# EAGLE design MaTouch ESP32-S3 MaUWB SPI TFT Touch 3.95'' ST7796  v1.1 (EAGLE 6.1)
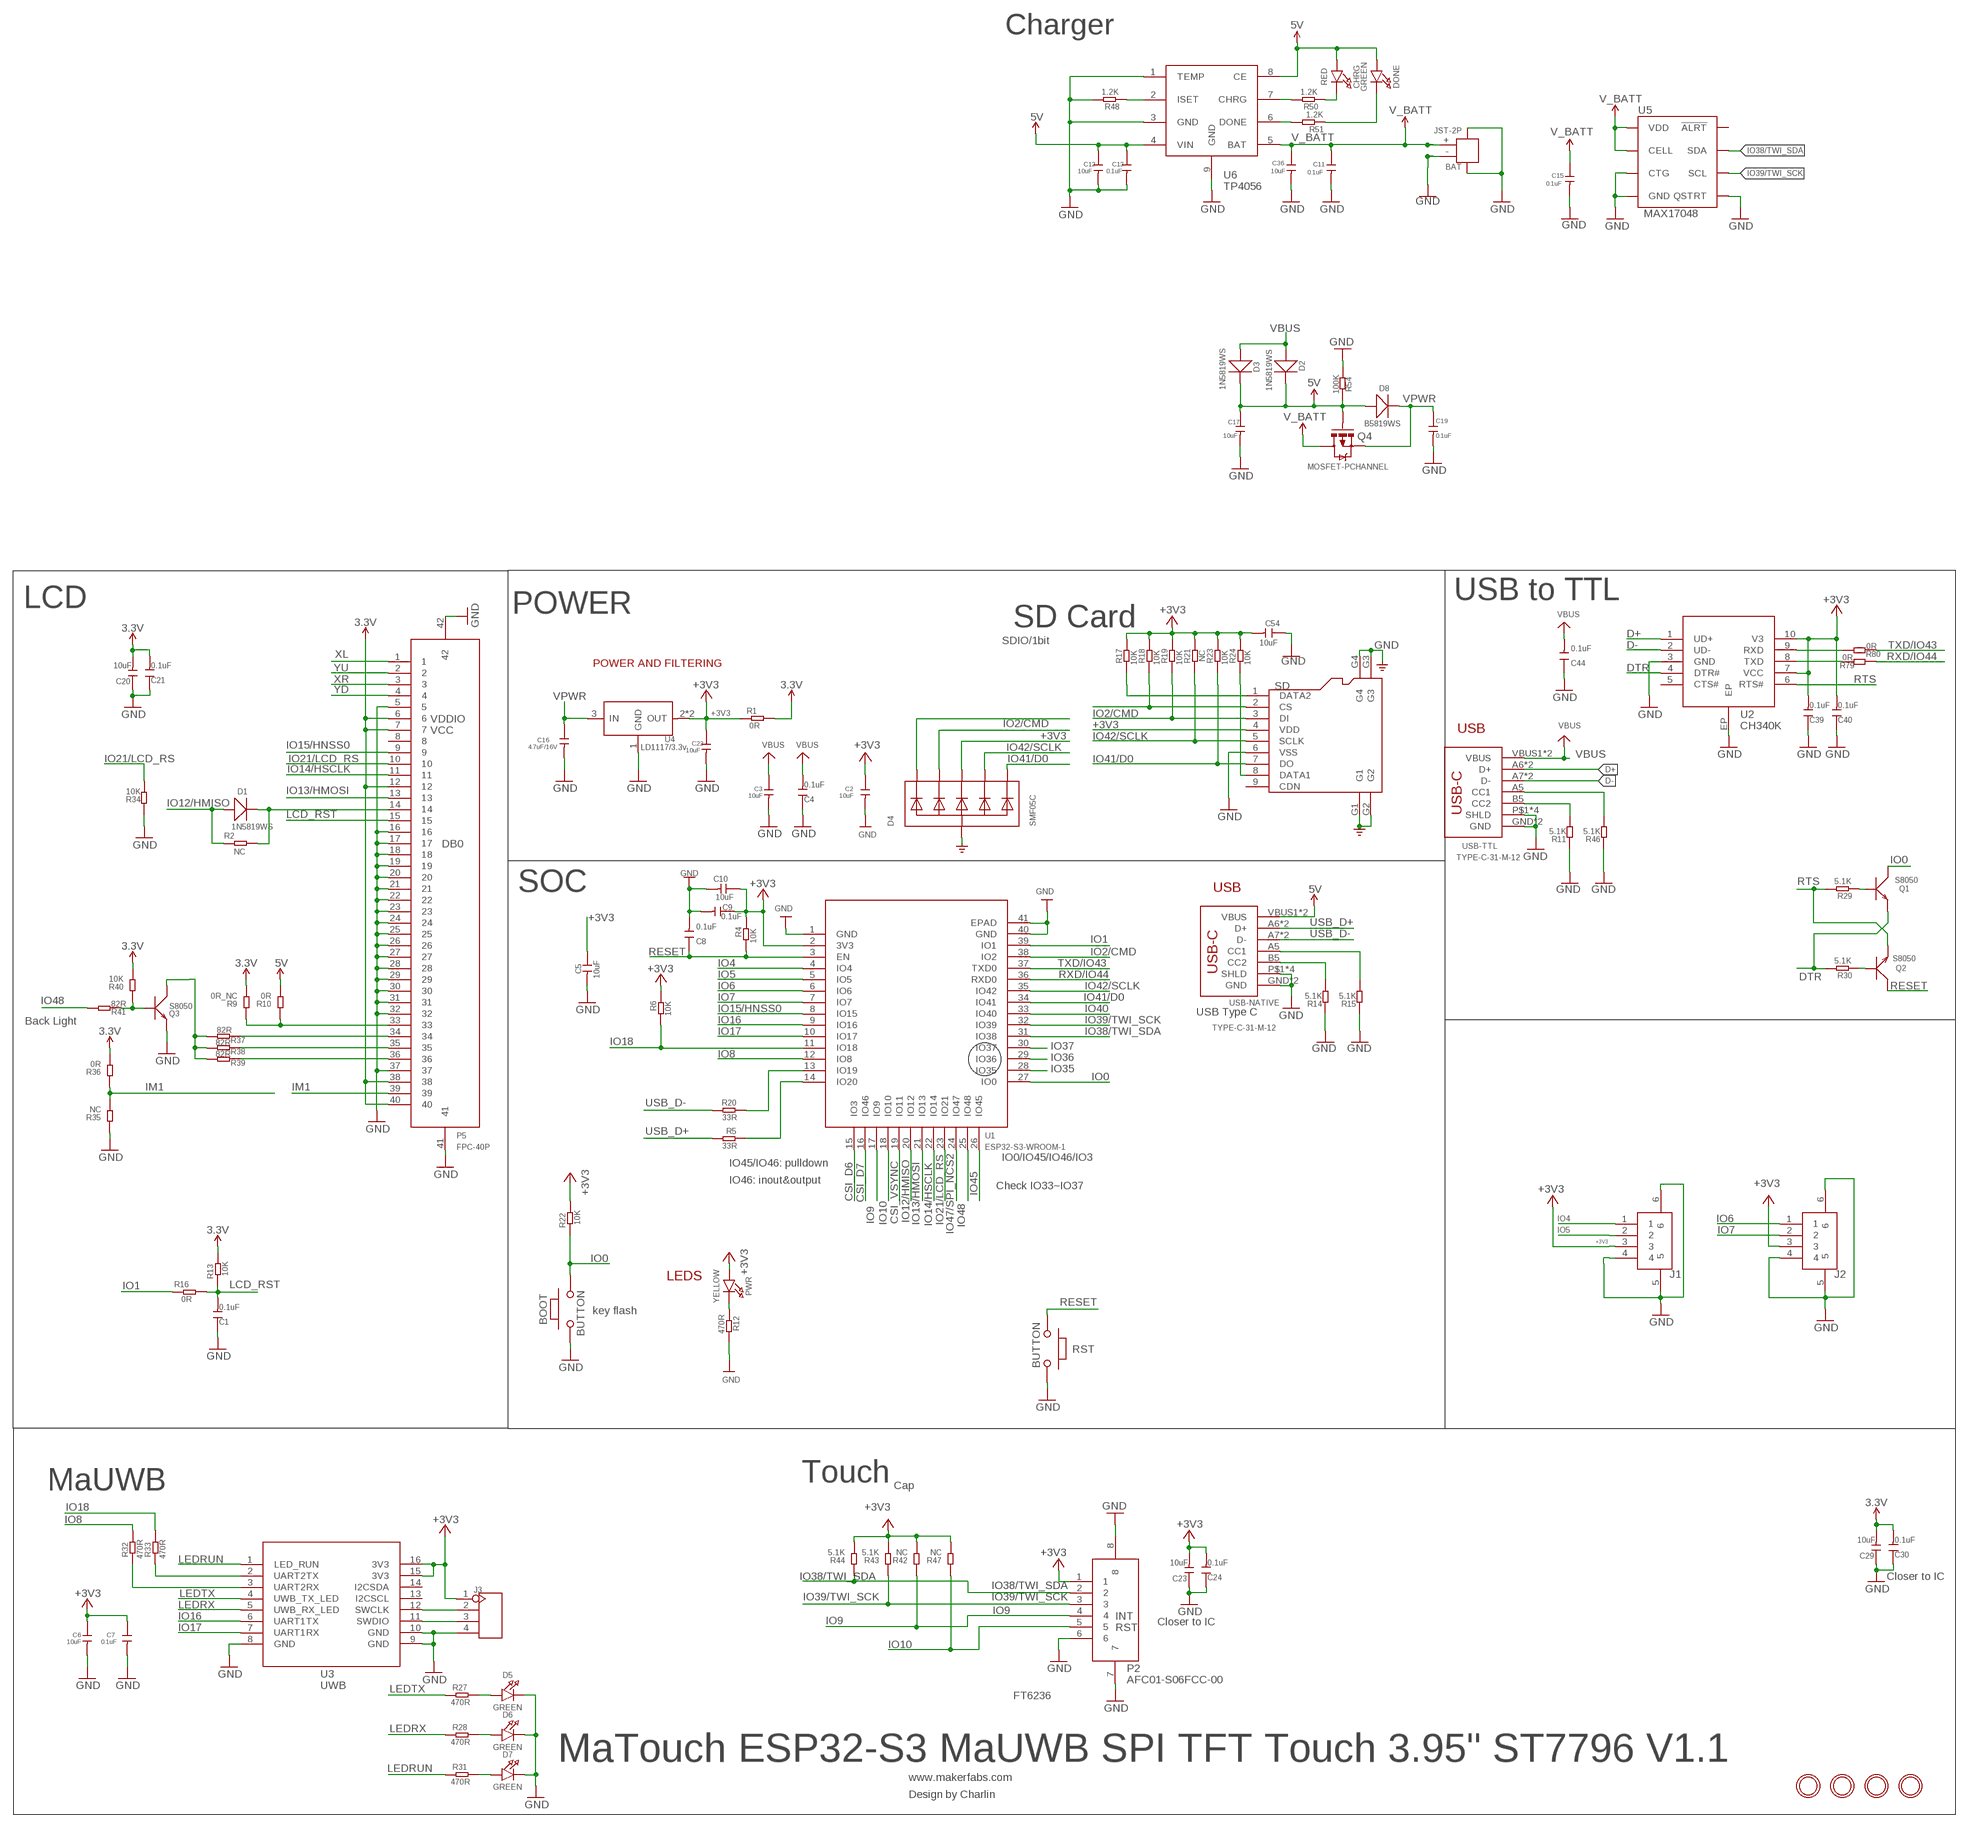
[diagram p0: schematic, sheet 1]

## Parts
BAT  JST-2P  JST-2P-SMD'2.0'  [HW2-SMD-2.0-90D]
BOOT  BUTTON  PB157  [157SW]
C1  0.1uF  DISCRETE_C-0603  [DISCRETE_C0603]
C2  10uF  C-0603  [C0603]
C3  10uF  C-0603  [C0603]
C4  0.1uF  DISCRETE_C-0603  [DISCRETE_C0603]
C5  10uF  DISCRETE_C-0603  [DISCRETE_C0603]
C6  10uF  C-0603  [C0603]
C7  0.1uF  C-0603  [C0603]
C8  0.1uF  DISCRETE_C-0603  [DISCRETE_C0603]
C9  0.1uF  DISCRETE_C-0603  [DISCRETE_C0603]
C10  10uF  DISCRETE_C-0603  [DISCRETE_C0603]
C11  0.1uF  C-0603  [C0603]
C12  10uF  C-0603  [C0603]
C13  0.1uF  C-0603  [C0603]
C15  0.1uF  C-0603  [C0603]
C16  4.7uF/16V  C-0603  [C0603]
C17  10uF  C-0603  [C0603]
C19  0.1uF  C-0603  [C0603]
C20  10uF  DISCRETE_C-0603  [DISCRETE_C0603]
C21  0.1uF  DISCRETE_C-0603  [DISCRETE_C0603]
C22  10uF  C-0603  [C0603]
C23  10uF  DISCRETE_C-0603  [DISCRETE_C0603]
C24  0.1uF  DISCRETE_C-0603  [DISCRETE_C0603]
C29  10uF  DISCRETE_C-0603  [DISCRETE_C0603]
C30  0.1uF  DISCRETE_C-0603  [DISCRETE_C0603]
C36  10uF  C-0603  [C0603]
C39  0.1uF  DISCRETE_C-0603  [DISCRETE_C0603]
C40  0.1uF  DISCRETE_C-0603  [DISCRETE_C0603]
C44  0.1uF  DISCRETE_C-0603  [DISCRETE_C0603]
C54  10uF  DISCRETE_C-0603  [DISCRETE_C0603]
CHRG  RED  LED0805_NOOUTLINE  [CHIPLED_0805_NOOUTLINE]
D1  1N5819WS  D'0805'  [SOD323]
D2  1N5819WS  D'0805'  [SOD323]
D3  1N5819WS  D'0805'  [SOD323]
D4  SMF05C  TVSARRAY_5LANE  [SOT363]
D5  GREEN  LED0805_NOOUTLINE  [CHIPLED_0805_NOOUTLINE]
D6  GREEN  LED0805_NOOUTLINE  [CHIPLED_0805_NOOUTLINE]
D7  GREEN  LED0805_NOOUTLINE  [CHIPLED_0805_NOOUTLINE]
D8  B5819WS  D'0805'  [SOD323]
DONE  GREEN  LED0805_NOOUTLINE  [CHIPLED_0805_NOOUTLINE]
H1  MICROBUILDER_MOUNTINGHOLE3.0THIN  [MICROBUILDER_MOUNTINGHOLE_3.0_PLATEDTHIN]
H2  MICROBUILDER_MOUNTINGHOLE3.0THIN  [MICROBUILDER_MOUNTINGHOLE_3.0_PLATEDTHIN]
H3  MICROBUILDER_MOUNTINGHOLE3.0THIN  [MICROBUILDER_MOUNTINGHOLE_3.0_PLATEDTHIN]
H4  MICROBUILDER_MOUNTINGHOLE3.0THIN  [MICROBUILDER_MOUNTINGHOLE_3.0_PLATEDTHIN]
J1  CON4-1.25P-SMD  [SMD4-125P-1000L525W350H]
J2  CON4-1.25P-SMD  [SMD4-125P-1000L525W350H]
J3  HEADER-4P-60/35MILROUND  [4P-65/35ROUND]
P2  AFC01-S06FCC-00  [SMD8-50P-740L535W]
P5  FPC-40P  [SMD42-50P-2560L490W]
PWR  YELLOW  LED0805_NOOUTLINE  [CHIPLED_0805_NOOUTLINE]
Q1  S8050  TRANSISTOR-NPN-SOT23  [SOT23]
Q2  S8050  TRANSISTOR-NPN-SOT23  [SOT23]
Q3  S8050  TRANSISTOR-NPN-SOT23  [SOT23]
Q4  MOSFET-PCHANNEL  [SOT23-3]
R1  0R  R-0603  [R0603]
R2  NC  R-0603  [R0603]
R4  10K  R-0603  [R0603]
R5  33R  R-0603  [R0603]
R6  10K  R-0603  [R0603]
R9  0R_NC  DISCRETE_R-0603  [DISCRETE_R0603]
R10  0R  DISCRETE_R-0603  [DISCRETE_R0603]
R11  5.1K  DISCRETE_R-0603  [DISCRETE_R0603]
R12  470R  R-0603  [R0603]
R13  10K  R-0603  [R0603]
R14  5.1K  DISCRETE_R-0603  [DISCRETE_R0603]
R15  5.1K  DISCRETE_R-0603  [DISCRETE_R0603]
R16  0R  R-0603  [R0603]
R17  10K  R-0603  [R0603]
R18  10K  R-0603  [R0603]
R19  10K  R-0603  [R0603]
R20  33R  R-0603  [R0603]
R21  NC  R-0603  [R0603]
R22  10K  R-0603  [R0603]
R23  10K  R-0603  [R0603]
R24  10K  R-0603  [R0603]
R27  470R  R-0603  [R0603]
R28  470R  R-0603  [R0603]
R29  5.1K  R-0603  [R0603]
R30  5.1K  R-0603  [R0603]
R31  470R  R-0603  [R0603]
R32  470R  R-0603  [R0603]
R33  470R  R-0603  [R0603]
R34  10K  DISCRETE_R-0603  [DISCRETE_R0603]
R35  NC  DISCRETE_R-0603  [DISCRETE_R0603]
R36  0R  DISCRETE_R-0603  [DISCRETE_R0603]
R37  82R  DISCRETE_R-0603  [DISCRETE_R0603]
R38  82R  DISCRETE_R-0603  [DISCRETE_R0603]
R39  82R  DISCRETE_R-0603  [DISCRETE_R0603]
R40  10K  DISCRETE_R-0603  [DISCRETE_R0603]
R41  82R  DISCRETE_R-0603  [DISCRETE_R0603]
R42  NC  DISCRETE_R-0603  [DISCRETE_R0603]
R43  5.1K  DISCRETE_R-0603  [DISCRETE_R0603]
R44  5.1K  DISCRETE_R-0603  [DISCRETE_R0603]
R46  5.1K  DISCRETE_R-0603  [DISCRETE_R0603]
R47  NC  DISCRETE_R-0603  [DISCRETE_R0603]
R48  1.2K  R-0603  [R0603]
R50  1.2K  R-0603  [R0603]
R51  1.2K  R-0603  [R0603]
R54  100K  R-0603  [R0603]
R79  0R  R-0603  [R0603]
R80  0R  R-0603  [R0603]
RST  BUTTON  PB157  [157SW]
SD  HOLDER-MICROSD-9P  [9P-SMD-W/-RING]
U1  ESP32-S3-WROOM-1  [ESP32-S3-WROOM-1]
U2  CH340K  [ESOP-10-EP-150MIL]
U3  UWB  [UWB]
U4  LD1117/3.3v  LD1117'SOT89'  [SOT89]
U5  MAX17048  MAX17048DFN8  [DFN-8]
U6  TP4056  [SOP8-1.27P]
USB-NATIVE  TYPE-C-31-M-12  [TYPE-C-31-M-12]
USB-TTL  TYPE-C-31-M-12  [TYPE-C-31-M-12]

## Nets
5V: C12.1 C13.1 C17.1 CHRG.A D2.- D3.- D8.+ DONE.A Q4.1(G) R10.2 R54.2 U6.4(VIN) U6.8(CE) USB-NATIVE.VBUS1(VBUS) USB-NATIVE.VBUS2(VBUS)
+3V3: C2.1 C5.1 C6.1 C7.1 C9.1 C10.1 C20.2 C21.2 C22.1 C23.2 C24.2 C29.2 C30.2 C39.2 C40.2 C54.2 D4.4(C3) J1.3 J2.3 J3.1 P2.1 P5.6 P5.7 P5.12 P5.38 P5.40 PWR.A R1.1 R1.2 R4.2 R6.2 R9.2 R13.2 R17.2 R18.2 R19.2 R21.2 R22.2 R23.2 R24.2 R36.2 R40.2 R42.2 R43.2 R44.2 R47.2 SD.4(VDD) U1.2(3V3) U2.7(VCC) U2.10(V3) U3.15(3V3) U3.16(3V3) U4.2(OUT) U4.4(OUT) ; supply symbol labelled 3.3V
CSI_D6: U1.15(IO3)
CSI_D7: U1.16(IO46)
CSI_VSYNC: U1.19(IO11)
D+: U2.1(UD+) USB-TTL.A6(D+) USB-TTL.B6(D+)
D-: U2.2(UD-) USB-TTL.A7(D-) USB-TTL.B7(D-)
DTR: Q1.2(E) R30.2 U2.4(DTR#)
GND: BAT.3 BAT.4 BAT.- BOOT.1 C1.1 C2.2 C3.2 C4.1 C5.2 C6.2 C7.2 C8.2 C9.2 C10.2 C11.2 C12.2 C13.2 C15.2 C16.2 C17.2 C19.2 C20.1 C21.1 C22.2 C23.1 C24.1 C29.1 C30.1 C36.2 C39.1 C40.1 C44.1 C54.1 D4.2(A) D5.C D6.C D7.C J1.4 J1.5 J1.6 J2.4 J2.5 J2.6 J3.4 P2.6 P2.7 P2.8 P5.5 P5.16 P5.17 P5.18 P5.19 P5.20 P5.21 P5.22 P5.23 P5.24 P5.25 P5.26 P5.27 P5.28 P5.29 P5.30 P5.31 P5.32 P5.37 P5.41 P5.42 Q3.2(E) R11.1 R12.2 R14.1 R15.1 R34.1 R35.1 R46.1 R48.2 R54.1 RST.1 SD.6(VSS) SD.G1 SD.G2 SD.G3 SD.G4 U1.1(GND) U1.40(GND) U1.41(EPAD) U2.3(GND) U2.EP U3.8(GND) U3.9(GND) U3.10(GND) U4.1(GND) U5.1(CTG) U5.4(GND) U5.6(QSTRT) U5.9(GND) U6.1(TEMP) U6.3(GND) U6.9(GND) USB-NATIVE.GND USB-NATIVE.GND2(GND) USB-NATIVE.P$1(SHLD) USB-NATIVE.P$2(SHLD) USB-NATIVE.P$3(SHLD) USB-NATIVE.P$4(SHLD) USB-TTL.GND USB-TTL.GND2(GND) USB-TTL.P$1(SHLD) USB-TTL.P$2(SHLD) USB-TTL.P$3(SHLD) USB-TTL.P$4(SHLD)
IM1: P5.39 R35.2 R36.1
IO0: BOOT.2 Q1.3(C) R22.1 U1.27(IO0)
IO1: R16.1 U1.39(IO1)
IO1/CS: D4.1(C1) R18.1 SD.2(CS)
IO2/CMD: D4.3(C2) R19.1 SD.3(DI) U1.38(IO2)
IO4: J1.1 U1.4(IO4)
IO5: J1.2 U1.5(IO5)
IO6: J2.1 U1.6(IO6)
IO7: J2.2 U1.7(IO7)
IO8: R32.2 U1.12(IO8)
IO9: P2.4 R42.1 U1.17(IO9)
IO10: P2.5 R47.1 U1.18(IO10)
IO12/HMISO: D1.+ R2.1 U1.20(IO12)
IO13/HMOSI: P5.13 U1.21(IO13)
IO14/HSCLK: P5.11 U1.22(IO14)
IO15/HNSS0: P5.9 U1.8(IO15)
IO16: U1.9(IO16) U3.6(UART1TX)
IO17: U1.10(IO17) U3.7(UART1RX)
IO18: R6.1 R33.2 U1.11(IO18)
IO21/LCD_RS: P5.10 R34.2 U1.23(IO21)
IO35: U1.28(IO35)
IO36: U1.29(IO36)
IO37: U1.30(IO37)
IO38/TWI_SDA: P2.2 R44.1 U1.31(IO38) U5.8(SDA)
IO39/TWI_SCK: P2.3 R43.1 U1.32(IO39) U5.7(SCL)
IO40: U1.33(IO40)
IO41/D0: D4.6(C5) R23.1 SD.7(DO) U1.34(IO41)
IO42/SCLK: D4.5(C4) R21.1 SD.5(SCLK) U1.35(IO42)
IO45: U1.26(IO45)
IO47/SPI_NCS2: U1.24(IO47)
IO48: R41.2 U1.25(IO48)
LCD_RST: C1.2 P5.15 R13.1 R16.2
LEDRUN: R31.1 U3.1(LED_RUN)
LEDRX: R28.1 U3.5(UWB_RX_LED)
LEDTX: R27.1 U3.4(UWB_TX_LED)
N$1: R46.2 USB-TTL.A5(CC1)
N$2: D5.A R27.2
N$3: D6.A R28.2
N$4: D1.- P5.14 R2.2
N$5: Q2.1(B) R30.1
N$6: D7.A R31.2
N$7: PWR.C R12.1
N$8: Q1.1(B) R29.1
N$9: R51.2 U6.6(DONE)
N$10: R33.1 U3.2(UART2TX)
N$11: R32.1 U3.3(UART2RX)
N$12: R48.1 U6.2(ISET)
N$13: R50.2 U6.7(CHRG)
N$14: R15.2 USB-NATIVE.A5(CC1)
N$15: R20.2 U1.13(IO19)
N$16: R5.2 U1.14(IO20)
N$17: R14.2 USB-NATIVE.B5(CC2)
N$18: R11.2 USB-TTL.B5(CC2)
N$19: CHRG.C R50.1
N$20: P5.34 R37.1
N$21: P5.35 R38.1
N$22: P5.36 R39.1
N$23: Q3.1(B) R40.1 R41.1
N$24: Q3.3(C) R37.2 R38.2 R39.2
N$26: P5.33 R9.1 R10.1
N$27: J3.3 U3.11(SWDIO)
N$28: J3.2 U3.12(SWCLK)
N$29: DONE.C R51.1
N$36: R80.2 U2.9(RXD)
N$37: R79.2 U2.8(TXD)
N$47: R17.1 SD.1(DATA2)
N$48: R24.1 SD.8(DATA1)
RESET: C8.1 Q2.3(C) R4.1 RST.2 U1.3(EN)
RTS: Q2.2(E) R29.2 U2.6(RTS#)
RXD/IO44: R79.1 U1.36(RXD0)
TXD/IO43: R80.1 U1.37(TXD0)
USB_D+: R5.1 USB-NATIVE.A6(D+) USB-NATIVE.B6(D+)
USB_D-: R20.1 USB-NATIVE.A7(D-) USB-NATIVE.B7(D-)
V_BATT: BAT.+ C11.1 C15.1 C36.1 Q4.3(D) U5.2(CELL) U5.3(VDD) U6.5(BAT)
VBUS: C3.1 C4.2 C44.2 D2.+ D3.+ USB-TTL.VBUS1(VBUS) USB-TTL.VBUS2(VBUS)
VPWR: C16.1 C19.1 D8.- Q4.2(S) U4.3(IN)
XL: P5.1
XR: P5.3
YD: P5.4
YU: P5.2
Unconnected: P5.8 SD.9(CDN) U2.5(CTS#) U3.13(I2CSCL) U3.14(I2CSDA) U5.5(!ALRT)

## Notes on the sheet
- Charger
- LCD | USB to TTL
- POWER
- SD Card
- SDIO/1bit
- POWER AND FILTERING
- VDDIO
- VCC | USB
- DB0
- SOC | USB
- USB Type C
- Back Light
- IO0/IO45/IO46/IO3
- IO45/IO46: pulldown
- IO46: inout&output
- Check IO33~IO37
- LEDS
- key flash
- Touch
- MaUWB | Cap
- Closer to IC
- INT
- Closer to IC
- RST
- FT6236
- MaTouch ESP32-S3 MaUWB SPI TFT Touch 3.95" ST7796 V1.1
- www.makerfabs.com
- Design by Charlin

## Library data of the parts
BAT = Connector-new:JST-2P-SMD: 2P-SMD-1.0-90D:320110054;2P-SMD-2.0-90D:320110026
BOOT RST = MySMD:PB157
C1 C4 C5 C8-C10 C20 C21 C23 C24 C29 C30 C39 C40 C44 C54 = A9G:DISCRETE_C*: Ceramic Capacitors
C2 C3 C6 C7 C11-C13 C15-C17 C19 C22 C36 = Discrete:C*: Ceramic Capacitors
CHRG D5-D7 DONE PWR = microbuilder:LED: LED 0603 - 0603 Surface Mount Package 2mA: Green LED - Low Power (3.9mcd, 2ma, 1.7Vf) - Digikey: 475-2709-2-ND Orange LED - Low Power (9.8mcd, 2ma, 1.8Vf) - Digikey: 475-1194-2-ND Red LED - Low Power (5mcd, 2ma, 1.8Vf) - Digikey: 475-1195-2-ND Yellow LED - Low Power (7mcd, 2ma, 1.8Vf) - Digikey: 475-1196-2-ND 5mA: Blue LED - Low Power (17mcd, 5ma, 2.9Vf) - Digikey: LNJ937W8CRACT-ND 0805 - 0805 Surface Mount Package 2mA: Red LED (8.8mcd, 2mA, 1.8Vf, Clear) - Low Power [Digikey: 475-2510-1-ND] Green LED (5mcd, 2mA, 1.8Vf, Clear) - Low Power [Digikey: 475-2730-1-ND] Yellow LED (11.3mcd, 2mA, 1.8Vf, Clear) - Low Power [Digikey: 475-2555-1-ND] 20mA: Red LED (104mcd, 20mA, Diffused) - LS R976 [Digikey: 475-1278-6-ND] Red LED (12mcd, 20mA, 2.0Vf, Clear) - APT2012EC [Digikey: 754-1128-1-ND] Green LED (15mcd, 20mA, 2.2Vf, Clear) - APT2012GC [Digikey: 754-1131-1-ND] Orange LED (160mcd, 20mA, 2.1Vf, Clear) - APT2012SECK [Digikey: 754-1130-1-ND] 1206 - 1206 Surface Mount Package Green LED (26mcd, 20mA, Diffused) - LG N971 [Digikey: 475-1407-6-ND] Red LED (15mcd, 20mA, Diffused) - LH N974 [Digikey: 475-1416-6-ND] Cree - Cree High-Power Surface Mount LEDs XPEBWT-L1-0000-00D50 - White 111lm 350mA 2.9Vf 6200K 110° XTEAWT-00-0000-00000LEE3 - White 114lm 350mA 2.85Vf 5000K 115° Everlight - Everlight 45-21 Series Surface Mount LEDs 45-21/QK2C-B2832AC2CB2/2T - Warm White 2000mcd 20mA 3.25Vf 3050K 120° 45-21/LK2C-B38452C4CB2/2T - Nuetral White 2000mcd 20mA 3.25Vf 4150K 120° 45-21/LK2C-B50634C6CB2/2T - Cold White 2200mcd 20mA 3.25Vf 5650K 120° PLCC2 Reverse Mount LS T77K-J1L2-1-0-2-R18-Z - Red 11.25mcd 2mA 1.8Vf 630nm 120° LO T77K-L1M2-24-Z - Orange 19.6mcd 2mA 1.8Vf 606nm 120° LY T77K-K2M1-26-Z - Yellow 15.7mcd 2mA 1.8Vf 587nm 120°
D1-D3 D8 = Discrete:D*
D4 = microbuilder:TVSARRAY_5LANE: Voltage Transient Suppressor Array SOT363 SMF05C - 100W 5V: Digikey - SMF05CT1GOSCT-ND
H1-H4 = Adafruit UDA1334 I2S DAC:MICROBUILDER_MOUNTINGHOLE: Mounting Hole For #2 screws (0.086"/2.18mm width, 0.094"/2.4mm hole) use 2.5mm; BOM: EXCLUDE
J1 J2 = user:CON4-1.25P-SMD
J3 = Connector:HEADER-4P
P2 = self:AFC01-S06FCC-00
P5 = self:FPC-40P
Q1-Q3 = Discrete:TRANSISTOR-NPN*: NPN audion
Q4 = User-Submitted:MOSFET-PCHANNEL: Generic PMOSFET IRLML2244 - TRANS-11153 (SOT-23 -20V -4.3A) (1.Gate 2.Source 3.Drain) FQP27P06 - COM-10349 <http://www.sparkfun.com/products/10349> (TO-220 -60V -27A) (1.Gate 2.Source 3.Drain); PROD_ID: TRANS-08285
R1 R2 R4-R6 R12 R13 R16-R24 R27-R33 R48 R50 R51 R54 R79 R80 = Discrete:R*
R9-R11 R14 R15 R34-R44 R46 R47 = A9G:DISCRETE_R*
SD = Connector:HOLDER-MICROSD-9P
U1 = self:ESP32-S3-WROOM-1
U2 = sale:CH340K
U3 = sale:UWB
U4 = IC:LD1117: Low Drop Fixed And Adjustable Positive Voltage Regulators http://www.datasheetcatalog.org/datasheet/SGSThomsonMicroelectronics/mXuqtqv.pdf
U5 = SparkFun-IC-Power:MAX17048: Micropower 1-Cell Li+ ModelGauge SparkFun Products Qduino Mini <https://www.sparkfun.com/products/13614> (DEV-13614); PROD_ID: IC-12551
U6 = self:TP4056
USB-NATIVE USB-TTL = sale:TYPE-C-31-M-12

## Net classes
0 default: width 0.203 mm, drill 0.305 mm, clearance 0.152 mm
1 vbat: width 0.254 mm, drill 0.305 mm, clearance 0.152 mm

## Board
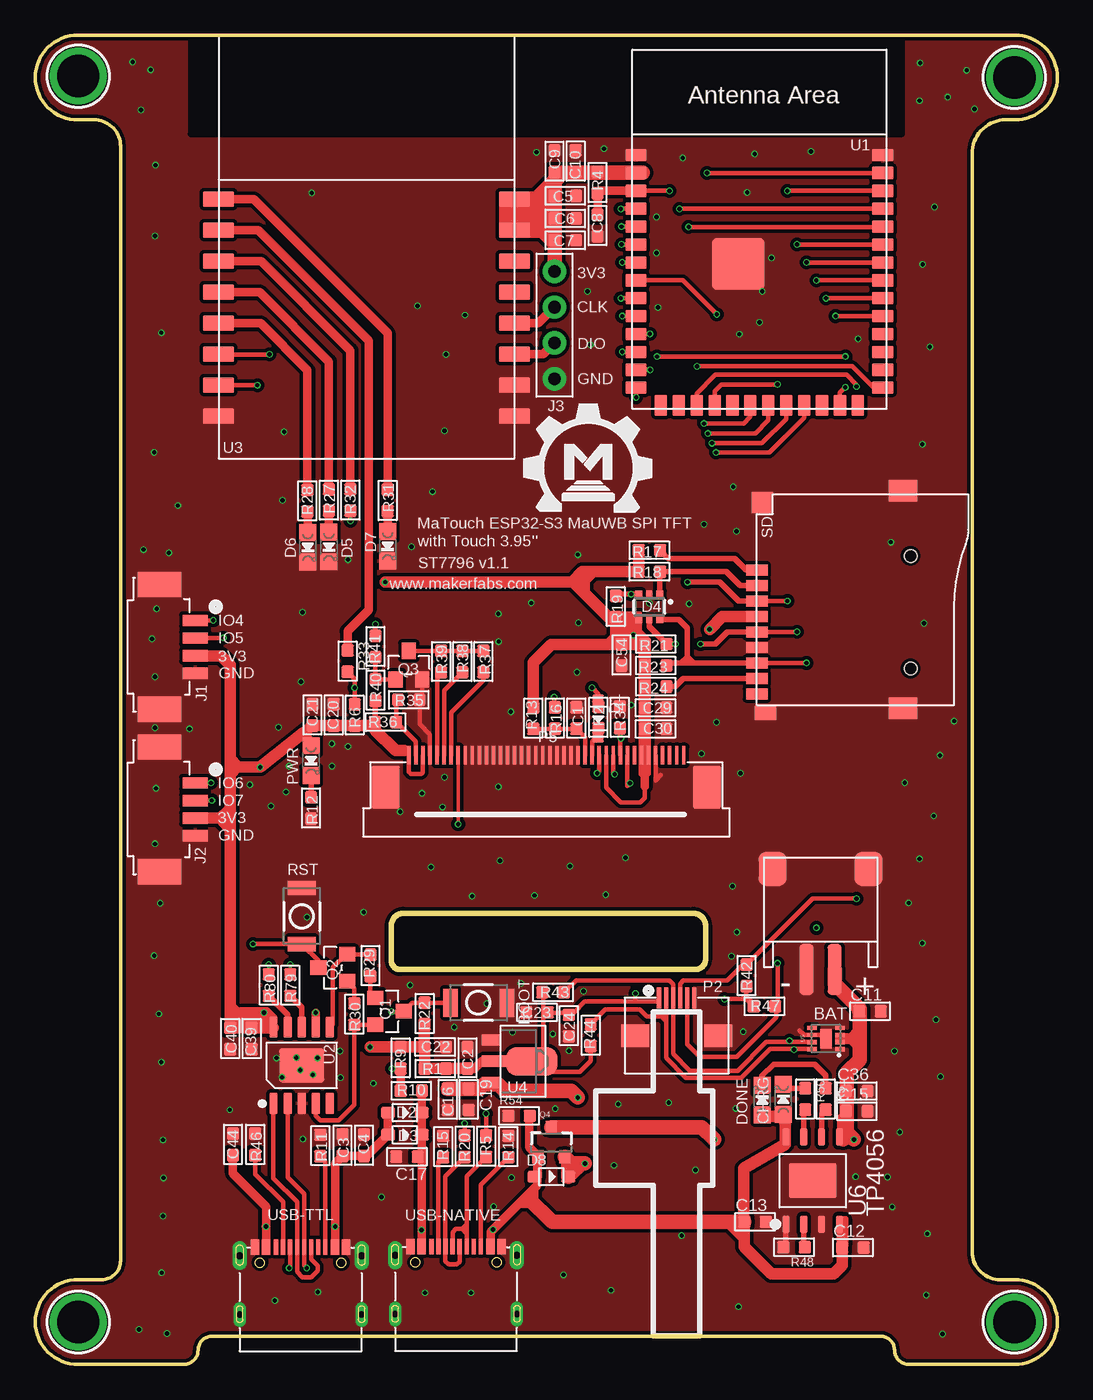
[diagram p1: board, top side]
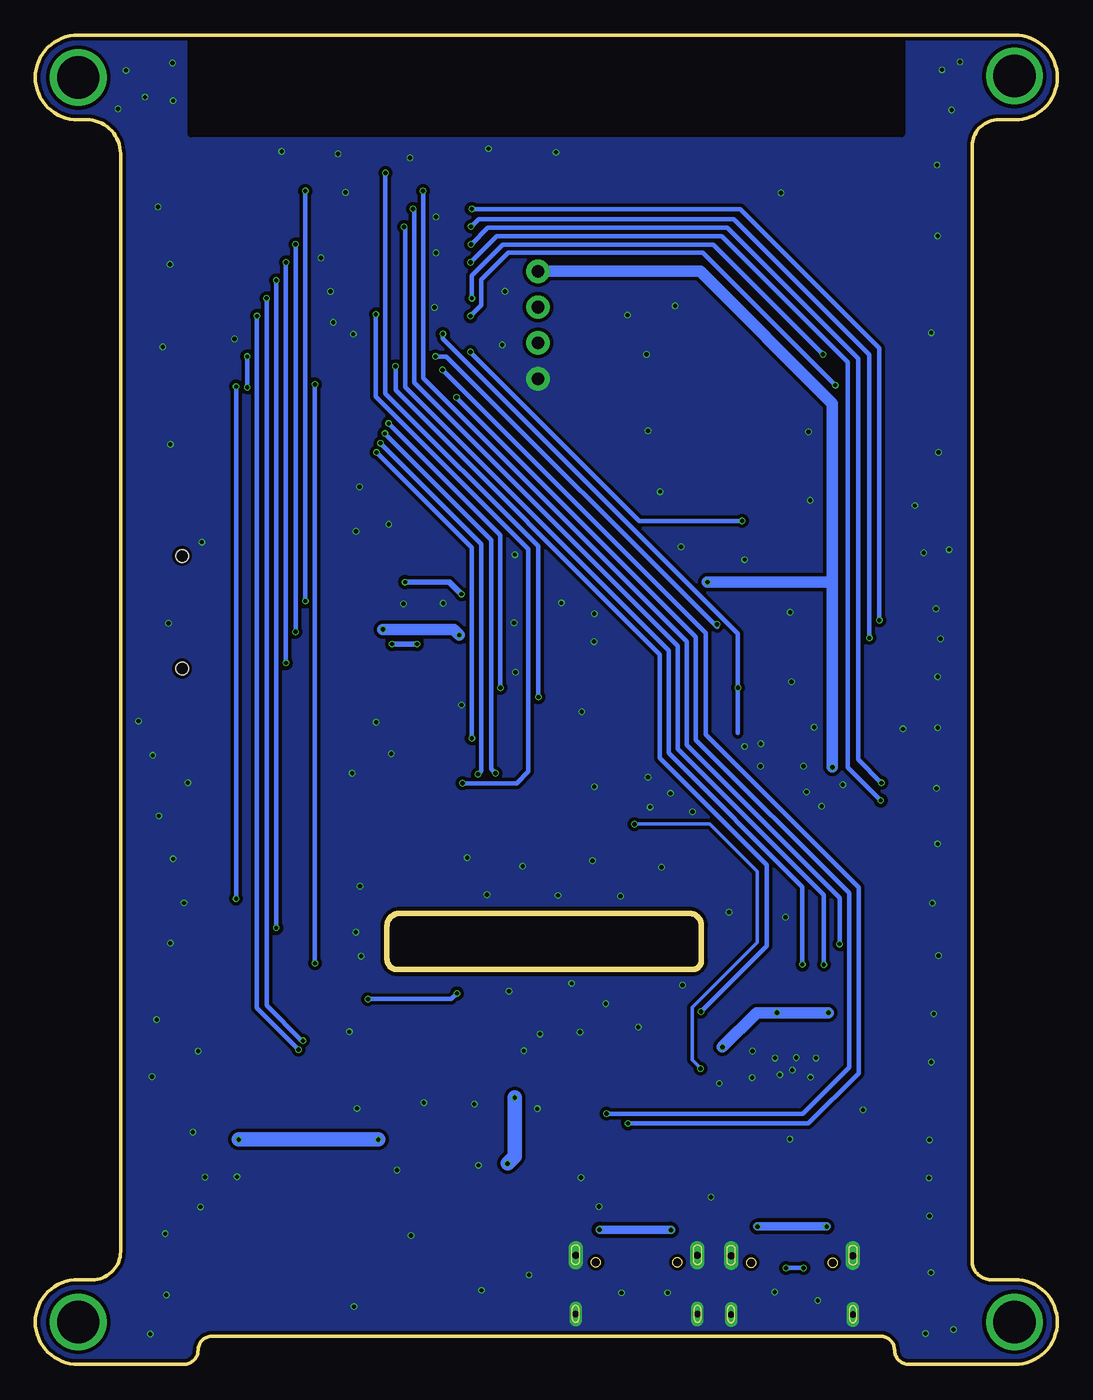
[diagram p2: board, bottom side, seen from below]

Size 72.5 x 94.3 mm. Coordinates in mm from the lower left corner, seen from the top.
Outline: 61.95,0 69.45,0 arc182 69.45,6 68.45,6 arc-90 66.45,8 66.45,85.9 arc-90 68.85,88.3 69.45,88.3 arc182 69.45,94.3 3.05,94.3 arc182 3.05,88.3 4.17,88.3 arc-90 6.05,86.42 6.05,7.34 arc-90 4.7,6 3.05,6 arc182 3.05,0 10.55,0 arc90 11.55,1 arc-90 12.55,2 59.95,2 arc-90 60.95,1 arc90 61.95,0
Outline: 26.13,32 46.64,32 arc-90 47.55,31.1 47.55,28.75 arc-90 46.8,28 25.91,28 arc-90 25.25,28.66 25.25,31.12 arc-90 26.13,32
Copper layers (1*16): Top 0.035mm / dielectric 1.5mm / Bottom 0.035mm
Design rules: minimum track width 6mil, minimum drill 10mil, track to track 8mil, track to pad 8mil, pad to pad 8mil, via to via 8mil, smd to smd 0mil, copper to edge 10mil, drill to drill 10mil, minimum pad ring 3mil, minimum via ring 3mil, stop-mask expansion 2mil, vias tented up to drill 100mil, thermal gap 0mil
tRestrict: area 11,87.3 to 61.4,95
bRestrict: area 11,87.3 to 61.4,95

### Footprints (pad centres in the part's own frame; a part is rotated, then mirrored left to right if it is on the bottom)
HW2-SMD-2.0-90D = smd 2 x 2.4: 3 3.4,-2.181; 4 -3.4,-2.181 | smd 1 x 3.6: + -1,4.953; - 1,4.953
157SW = smd 1.016 x 1.981: 1 0,0; 2 4,0
DISCRETE_C0603 = smd 0.889 x 0.889: 1 -0.762,0; 2 0.762,0
C0603 = smd 0.889 x 0.889: 1 -0.762,0; 2 0.762,0
CHIPLED_0805_NOOUTLINE = smd 1.2 x 1.2: A 0,-1.05; C 0,1.05
SOD323 = smd 1 x 0.8: + -1.2,0; - 1.2,0
SOT363 = smd 0.5 x 0.5: 1 -0.75,-0.9; 3 0.75,-0.9; 4 0.75,0.9; 6 -0.75,0.9 | smd 0.4 x 0.5: 2 0,-0.9; 5 0,0.9
MICROBUILDER_MOUNTINGHOLE_3.0_PLATEDTHIN = drill 3 pad 3.6: P$1 0,0
SMD4-125P-1000L525W350H = smd 0.8 x 1.8: 1 -1.875,1.266; 2 -0.625,1.266; 3 0.625,1.266; 4 1.875,1.266 | smd 1.8 x 3.1: 5 4.425,-1.266; 6 -4.425,-1.266
4P-65/35ROUND = drill 0.889 pad 1.651: 1 0,3.81; 2 0,1.27; 3 0,-1.27; 4 0,-3.81
SMD8-50P-740L535W = smd 0.3 x 1.5: 1 -1.25,0; 2 -0.75,0; 3 -0.25,0; 4 0.25,0; 5 0.75,0; 6 1.25,0 | smd 2 x 1.6: 7 2.95,-2.68; 8 -2.95,-2.68
SMD42-50P-2560L490W = smd 0.3 x 1.3: 1 9.75,0; 2 9.25,0; 3 8.75,0; 4 8.25,0; 5 7.75,0; 6 7.25,0; 7 6.75,0; 8 6.25,0; 9 5.75,0; 10 5.25,0; 11 4.75,0; 12 4.25,0; 13 3.75,0; 14 3.25,0; 15 2.75,0; 16 2.25,0; 17 1.75,0; 18 1.25,0; 19 0.75,0; 20 0.25,0; 21 -0.25,0; 22 -0.75,0; 23 -1.25,0; 24 -1.75,0; 25 -2.25,0; 26 -2.75,0; 27 -3.25,0; 28 -3.75,0; 29 -4.25,0; 30 -4.75,0; 31 -5.25,0; 32 -5.75,0; 33 -6.25,0; 34 -6.75,0; 35 -7.25,0; 36 -7.75,0; 37 -8.25,0; 38 -8.75,0; 39 -9.25,0; 40 -9.75,0 | smd 2 x 3: 41 -11.4,-2.25; 42 11.4,-2.25
SOT23 = smd 1.016 x 1.143: 1 -0.95,-1.016; 2 0.95,-1.016; 3 0,1.016
SOT23-3 = smd 0.8 x 0.9: 1 -0.95,-1; 2 0.95,-1; 3 0,1.1
R0603 = smd 0.889 x 0.889: 1 -0.762,0; 2 0.762,0
DISCRETE_R0603 = smd 0.889 x 0.889: 1 -0.762,0; 2 0.762,0
9P-SMD-W/-RING = smd 1.524 x 0.762: 1 0,4.4; 2 0,3.3; 3 0,2.2; 4 0,1.1; 5 0,0; 6 0,-1.1; 7 0,-2.2; 8 0,-3.3; 9 0,-4.4 | smd 1.524 x 1.016: G1 0.6,-5.746 | smd 2.032 x 1.524: G2 10.373,-5.4; G3 10.373,10 | smd 1.524 x 1.524: G4 0.392,9.181 | hole 0.889: 10.9,-2.6; 10.9,5.4
ESP32-S3-WROOM-1 = smd 1.5 x 0.9: 1 -8.75,5.26; 2 -8.75,3.99; 3 -8.75,2.72; 4 -8.75,1.45; 5 -8.75,0.18; 6 -8.75,-1.09; 7 -8.75,-2.36; 8 -8.75,-3.63; 9 -8.75,-4.9; 10 -8.75,-6.17; 11 -8.75,-7.44; 12 -8.75,-8.71; 13 -8.75,-9.98; 14 -8.75,-11.25; 27 8.75,-11.25; 28 8.75,-9.98; 29 8.75,-8.71; 30 8.75,-7.44; 31 8.75,-6.17; 32 8.75,-4.9; 33 8.75,-3.63; 34 8.75,-2.36; 35 8.75,-1.09; 36 8.75,0.18; 37 8.75,1.45; 38 8.75,2.72; 39 8.75,3.99; 40 8.75,5.26 | smd 0.9 x 1.5: 15 -6.985,-12.5; 16 -5.715,-12.5; 17 -4.445,-12.5; 18 -3.175,-12.5; 19 -1.905,-12.5; 20 -0.635,-12.5; 21 0.635,-12.5; 22 1.905,-12.5; 23 3.175,-12.5; 24 4.445,-12.5; 25 5.715,-12.5; 26 6.985,-12.5 | smd 3.7 x 3.7: 41 -1.5,-2.46
ESOP-10-EP-150MIL = smd 1.5 x 0.6: 1 -2.7,2; 2 -2.7,1; 3 -2.7,0; 4 -2.7,-1; 5 -2.7,-2; 6 2.7,-2; 7 2.7,-1; 8 2.7,0; 9 2.7,1; 10 2.7,2 | smd 2.4 x 3.2: EP 0,0
UWB = smd 2.2 x 1.1: 1 0,18.4; 2 0,16.2; 3 0,14; 4 0,11.8; 5 0,9.6; 6 0,7.4; 7 0,5.2; 8 0,3; 9 21,3; 10 21,5.2; 11 21,7.4; 12 21,9.6; 13 21,11.8; 14 21,14; 15 21,16.2; 16 21,18.4
SOT89 = smd 0.8 x 1.4: 1 -1.524,-1.905; 3 1.524,-1.905 | smd 0.8 x 1.9: 2 0,-1.651 | smd 2.032 x 3.65: 4 0,0.94
DFN-8 = smd 0.3 x 0.7: 1 -0.75,-0.99; 2 -0.25,-0.99; 3 0.25,-0.99; 4 0.75,-0.99; 5 0.75,0.99; 6 0.25,0.99; 7 -0.25,0.99; 8 -0.75,0.99 | smd 1.38 x 0.8: 9 0,0
SOP8-1.27P = smd 1.27 x 0.51: 1 -3.1,1.905; 2 -3.1,0.635; 3 -3.1,-0.635; 4 -3.1,-1.905; 5 3.1,-1.905; 6 3.1,-0.635; 7 3.1,0.635; 8 3.1,1.905 | smd 2.5 x 3.4: 9 0,0
TYPE-C-31-M-12 = smd 0.3 x 1.1: A5 -1.25,0.05; A6 -0.25,0.05; A7 0.25,0.05; A8 1.25,0.05; B5 1.75,0.05; B6 0.75,0.05; B7 -0.75,0.05; B8 -1.75,0.05 | smd 0.6 x 1.1: GND -3.225,0.05; GND2 3.225,0.05; VBUS1 -2.45,0.05; VBUS2 2.45,0.05 | drill 0.5 pad 1.016 long: P$1 4.32,-0.57; P$2 -4.32,-0.57 | drill 0.45 pad 0.9 long: P$3 -4.32,-4.75; P$4 4.32,-4.75

### Placement (x,y rotation side)
BAT  55.71,32.97 180 top
BOOT  33.45,25.66 180 top
C1  38.38,45.85 270 top
C2  30.66,21.74 90 top
C3  21.8,15.54 90 top
C4  23.32,15.54 270 top
C5  37.59,82.91 0 top
C6  37.59,81.31 0 top
C7  37.59,79.76 0 top
C8  39.88,80.8 270 top
C9  36.83,85.36 90 top
C10  38.33,85.37 90 top
C11  59.21,25.04 0 top
C12  57.99,8.28 0 top
C13  51.06,10.11 0 top
C15  58.27,17.96 0 top
C16  29.26,18.8 270 top
C17  26.37,14.73 180 top
C19  30.74,18.8 270 top
C20  21.16,46.08 270 top
C21  19.66,46.08 270 top
C22  28.36,22.51 0 top
C23  35.59,24.97 0 top
C24  37.85,24.03 90 top
C29  44,46.58 180 top
C30  44,45.09 180 top
C36  58.27,19.38 0 top
C39  15.34,23.11 90 top
C40  13.82,23.11 90 top
C44  14.02,15.6 270 top
C54  41.58,50.33 90 top
CHRG  53.06,18.8 0 top
D1  39.93,45.82 270 top
D2  26.22,17.86 0 top
D3  26.22,16.28 0 top
D4  43.55,53.75 180 top
D5  20.83,57.99 180 top
D6  19.33,57.96 180 top
D7  25,58.04 180 top
D8  36.6,13.31 0 top
DONE  51.56,18.75 0 top
H1  3.05,3 0 top
H2  69.45,3 0 top
H3  3.05,91.4 0 top
H4  69.45,91.3 0 top
J1  10.09,50.9 270 top
J2  10.09,39.37 270 top
J3  36.83,73.74 0 top
P2  45.5,26 0 top
P5  36.25,43.2 0 top
PWR  19.56,42.83 180 top
Q1  25.12,25.04 270 top
Q2  21.11,28.14 90 top
Q3  26.5,49.61 0 top
Q4  36.6,15.72 0 top
R1  28.37,20.98 0 top
R2  39.94,45.9 270 top
R4  39.88,83.85 90 top
R5  31.98,15.47 90 top
R6  22.66,46.07 270 top
R9  25.91,21.74 90 top
R10  26.67,19.41 0 top
R11  20.22,15.52 270 top
R12  19.56,39.47 270 top
R13  35.33,45.85 90 top
R14  33.56,15.44 270 top
R15  28.93,15.44 270 top
R16  36.86,45.85 270 top
R17  43.55,57.76 180 top
R18  43.55,56.24 180 top
R19  41.18,53.76 270 top
R20  30.46,15.47 90 top
R21  44.01,51.1 180 top
R22  27.61,24.89 270 top
R23  44.01,49.58 180 top
R24  44.01,48.08 180 top
R27  20.83,61.32 270 top
R28  19.31,61.26 270 top
R29  23.78,28.3 90 top
R30  22.63,24.84 270 top
R31  25,61.29 270 top
R32  22.35,61.32 270 top
R33  22.15,49.89 270 top
R34  41.47,45.9 270 top
R35  26.49,47.15 180 top
R36  24.84,45.57 180 top
R37  31.78,49.86 90 top
R38  30.3,49.86 90 top
R39  28.79,49.86 90 top
R40  24.13,47.83 270 top
R41  24.13,50.93 90 top
R42  50.45,27.58 270 top
R43  36.73,26.39 180 top
R44  39.4,23.34 270 top
R46  15.6,15.6 270 top
R47  51.72,25.4 180 top
R48  53.83,8.31 180 top
R50  54.61,18.82 270 top
R51  56.06,18.82 270 top
R54  34.32,17.63 0 top
R79  18.09,26.9 270 top
R80  16.56,26.9 270 top
RST  18.9,33.8 270 top
SD  51.18,51.96 0 top
U1  51.36,80.54 0 top
U2  18.9,21.21 90 top
U3  13.01,64.26 0 top
U4  34.27,21.5 270 top
U5  56.09,23.11 90 top
U6  55.15,13.03 90 top
U$1  [MAKERFABS_0.3]  35.11,60.51 0 top
USB-NATIVE  29.85,8.31 0 top
USB-TTL  18.82,8.28 0 top

### Tracks (layer width: path | path; a pad name or v marks a point on that pad's centre or on a via)
5V  (via drill 0.3)
  Top 0.305: 57.05,8.43 57.25,8.23 | 35.61,12.7 35.54,12.62 35.54,11.28 35.51,11.25 34.34,11.25 34.83,11.73 34.98,11.73 34.98,11.79 | U6.8 53.24,17.75 CHRG.A | D3.- D2.- 27.44,17.88 R10.2 | 27.4,14.67 27.34,14.73 C17.1
  Top 0.406: C12.1 57.05,8.46 U6.4 57.33,9.93 57.33,8.46 | 57.05,8.43 57.25,8.43 57.33,8.36 57.33,8.46 | 57.33,8.46 57.33,10.26 57.25,10.34 57.48,10.34 57.48,8.43 57.2,8.43 57.2,9.96
  Top 0.61: USB-NATIVE.VBUS1 v27.4,9.53 27.4,14.67 27.4,19.37 27.41,19.38 | USB-NATIVE.VBUS2 32.3,9.38 v32.46,9.55 35.61,12.7 35.61,14.68 | 27.42,19.39 R10.2 27.42,19.39 | 27.41,19.38 27.42,19.39 | 27.42,19.39 27.41,19.38 | 35.61,14.68 35.61,14.83 35.06,15.39 35.06,17.68 35.08,17.65 R54.2 | 35.61,14.68 Q4.1 35.65,13.31 D8.+
  Top 0.813: CHRG.A 53.06,17.6 | 53.06,17.6 53.06,17.35 53.19,17.35 53.19,15.6 | 53.19,15.6 53.19,17.48 arc90 53.06,17.6 | 53.06,17.6 51.66,17.6 arc-90 DONE.A | 57.2,9.96 57.25,9.96 57.25,7.04 56.65,6.43 52.2,6.43 50.3,8.33 50.3,8.97 | 50.3,8.97 C13.1 50.24,10.06 49.43,10.06 50.3,9.2 50.3,8.97 | 50.3,8.97 49.2,10.06 49.15,10.06 50.27,10.06 50.27,13.89 53.19,15.6 | 53.19,15.6 53.19,17.68 53.17,17.68
  Top 1.016: C13.1 36.66,10.11 34.98,11.79
  Bottom 0.61: v32.46,9.55 27.42,9.55 v27.4,9.53
+3V3  (via drill 0.3)
  Top 0.254: 40.92,53.01 41.23,53.31 42.93,53.31 42.93,52.07 43.56,51.44 43.56,41.88 43.28,41.6 43.16,41.6 42.9,41.86 42.9,50.55 42.45,51 42.62,51 | 42.62,51 43.16,51.54 | 13.82,38.68 13.49,38.35 13.49,38.2 | 16.87,23.88 16.84,23.88 16.83,23.86 | 42.62,51 42.62,51.09 | 42.62,51.09 42.62,51.1 42.62,51.09
  Top 0.305: P5.7 P5.6 43.5,42.53 43.23,42.27 | P2.1 44.25,25.73 42.85,25.73 | 42.85,25.73 38.99,25.73 38.18,24.92 37.87,24.92 | 37.87,24.92 36.4,24.92 | 36.4,24.92 36.02,24.92 36.02,26.34 R43.2 36.02,26.39 36.02,21.54 | 36.02,21.54 36.02,21.34 | 36.02,21.54 35.23,21.54 35.21,21.51 U4.4 35.66,21.05 35.66,20.98 35.59,20.9 35.59,20.83 35.66,20.75 38.64,20.75 39.4,21.51 R44.2 | C23.2 36.4,24.92 | C24.2 37.85,24.89 37.87,24.92 | P5.12 40.5,40.91 41.53,39.88 42.93,39.88 43.23,40.18 43.23,41.53 | 26.19,43.54 26.47,43.26 | 26.47,43.26 26.5,43.23 26.5,42.75 26.5,42.04 26.52,42.01 26.65,41.88 27.38,41.88 27.5,42 P5.38 | P5.40 26.5,43.23 26.47,43.26 | R42.2 50.45,26.26 | 50.45,26.26 50.45,26.09 | 50.45,26.09 50.45,25.91 | 50.45,25.91 R47.2 50.96,25.58 50.45,26.09 | 50.45,25.91 v48.9,25.91 | v42.57,26.31 42.57,25.73 42.85,25.73 | 50.45,26.09 50.45,26.26 | 50.45,26.26 50.45,26.24 50.14,25.93 50.45,25.93 50.9,25.48 | 38.94,55.96 38.94,55.5 38.81,55.37 39.02,55.37 39.83,56.19 39.35,56.19 39.3,56.24
  Top 0.406: D4.4 41.7,52.85 41.18,52.32 | 13.82,43.66 13.82,43.26 14.66,42.42 13.82,41.58 | 13.95,25.98 13.95,25.53 14.33,25.15 16.44,25.15 17,24.59 17,23.7 16.83,23.86 16.39,24.31 14.25,24.31 14.25,24.92 14.28,24.89 15.88,24.89 15.88,24.59 14.41,24.59 | PWR.A 19.56,44.31 19.05,44.82 | R6.2 24.03,45.31 | 24.13,45.34 24.13,45.47 | 24.13,45.47 R40.2 | R36.2 24.08,45.52 24.13,45.47
  Top 0.61: 27.61,22.5 C22.1 | C2.1 30.67,20.97 31.13,20.97 31.7,21.54 32.58,21.54 U4.2 U4.4 | 11.36,50.27 J1.3 | 13.76,38.74 13.82,38.68 | 16.87,23.88 U2.10 | R22.2 | R9.2 | U2.7 19.9,24.93 v19.89,24.94 | 13.87,42.37 13.82,42.42 | 43.23,41 43.23,41.53 43.23,42.27 C30.2 C29.2 43.23,48.07 R24.2 R23.2 R21.2 42.62,51.09 | 42.62,51.09 C54.2 41.18,51.5 | R19.2 41.18,52.48 41.18,52.32 | U1.2 39.96,84.53 R4.2 C10.1 36.84,84.61 C9.1 C5.1 | C5.1 C6.1 36.83,80.29 | 36.83,80.29 C7.1 36.83,79.55 J3.1 | U3.16 36.59,82.66 C5.1 | U3.15 36.66,80.46 36.83,80.29 | 16.23,23.9 16.21,23.88 | 42.62,51.09 42.61,51.08 42.47,51.08 42.42,51.13 v42.42,51.74 | 43.16,51.54 42.65,52.05 42.65,52.98 41.79,52.98 41.79,51.54 42.17,51.92 42.17,52.02 | 42.17,52.48 42.17,52.02 | 42.17,52.02 42.78,51.41 | 39.86,51.08 40.54,51.08 41.35,51.89 | 13.77,37.74 13.77,37.92 13.49,38.2 12.98,38.71 13.8,39.52
  Top 0.813: 27.61,22.5 R1.1 R1.2 C2.1 | 11.36,50.27 13.19,50.27 13.82,49.63 13.82,43.66 13.82,42.42 13.82,41.58 13.82,38.68 C40.2 C39.2 16.21,23.88 16.87,23.88 | J2.3 13.76,38.74 | R22.2 C22.1 R9.2 | R9.2 v23.75,22.5 | 13.87,42.37 v15.95,42.37 19.05,44.82 C21.2 C20.2 24.03,45.31 24.11,45.31 24.13,45.34 24.13,44.98 25.58,43.54 26.19,43.54 | 41.18,52.32 41.18,51.5 | R17.2 R18.2 40.21,56.24 39.3,56.24 38.81,56.24 38.08,55.5 | v16.23,24.94 16.23,23.9 | 41.18,52.48 39.55,54.1 38.15,55.5 38.08,55.5 | R13.2 35.33,49.81 36.6,51.08 39.86,51.08 42.47,51.08 | SD.4 48.75,53.06 v47.83,52.15 | 38.08,55.5 v24.82,55.5 | 38.94,55.96 38.94,54.86
  Top 1.016: 36.83,77.47 36.83,79.55 | 36.83,80.59 36.83,83.95 37.42,84.53 | 37.42,84.53 43.08,84.53 | 37.42,84.53 37.37,84.53 35.54,82.7 33.43,82.7 33.4,82.68 33.4,80.42 35.97,80.42 36.83,79.55 | 36.83,79.55 36.83,80.59 | 36.83,80.59 36.22,81.2 34.01,81.2 34.01,81.86 36,81.86 36.48,82.35
  Bottom 0.305: v48.9,25.91 42.98,25.91 v42.57,26.31
  Bottom 0.813: v23.75,22.5 21.31,24.94 v19.89,24.94 v16.23,24.94 | J3.1 25.33,77.55 15.95,68.17 15.95,55.5 | 15.95,55.5 v15.95,42.37 | v47.83,52.15 42.83,52.15 v42.42,51.74 | v24.82,55.5 16.01,55.5 15.95,55.5
D+
  Top 0.254: USB-TTL.A6 18.57,8.13 arc-90 18.57,8.13
  Top 0.305: U2.1 16.89,13.21 18.57,11.53 USB-TTL.A6 18.57,6.93 | USB-TTL.B6 19.57,7.45 20.04,6.99 20.04,6.63 19.59,6.17 18.95,6.17 18.57,6.55 18.57,8.13
D-  (via drill 0.3)
  Top 0.305: U2.2 17.9,13.27 19.07,12.09 USB-TTL.A7 19.07,7.01 v19.26,6.83 | 18.09,6.91 v18.01,6.83 arc90 18.07,6.89 USB-TTL.B7
  Bottom 0.305: v19.26,6.83 v18.01,6.83
DTR
  Top 0.305: U2.4 19.9,17.62 20.22,17.3 21.54,17.3 22.63,18.39 R30.2 24.09,24.08 Q1.2
GND  (via drill 0.3)
  Top 0.305: P5.5 44,41.43 44.38,41.81 | P5.37 28,44.7 27.26,45.44 R35.1 27.45,47.34 Q3.2 | U5.6 54.54,23.36 54.21,23.7 54.54,23.37 56.06,23.37 56.09,23.34 56.09,23.19 | 56.09,23.19 56.09,23.14 56.09,23.19 | U5.9 56.11,23.14 56.14,23.14 56.11,23.11 56.21,23.11 56.21,23.16 56.19,23.19 56.09,23.19
  Top 0.406: U6.1 53.24,8.48 R48.2
  other vias: 64.72,89.91 66.07,91.81 62.77,92.32 62.71,89.65 66.63,89.07 6.91,92.4 8.19,91.85 8.28,51.48 8.49,45.15 8.49,48.79 7.67,57.8 7.5,88.99 60.45,13.28 60.78,11.17 63.88,24.45 62.92,29.89 46.84,13.78 62.71,35.86 64.34,2.15 9.35,2.18 8.43,29 9.48,57.57 8.61,53.61 10.95,45.08 8.56,40.86 8.87,32.71 8.49,36.92 8.77,24.86 8.94,21.43 9.07,15.92 9.07,10.51 9.1,13.23 8.97,6.49 7.37,2.46 46.38,53.97 43.56,53.99 42.27,46.78 38.43,49.09 38.48,57.45 38.53,52.62 35.18,54.02 32.87,51.27 32.84,40.99 33.73,46.3 41.86,35.93 37.92,35.35 32.97,35.73 28.07,35.27 16.72,39.59 18.95,53.36 18.85,48.43 26.7,58.01 29.14,71.65 29.03,66.24 28.17,61.92 30.48,74.44 39.37,72.33 51.36,73.93 52.22,78.5 49.94,73.09 51.56,76.12 63.78,82.11 62.94,78.05 63.45,72.18 62.92,65.27 60.68,58.34 63.04,52.57 64.16,43.2 65.18,45.64 48.31,45.56 50.01,41.93 47.25,43.32 8.49,80.05 8.94,73.2 8.43,64.71 19.61,83.1 45.93,85.59 51.03,85.87 55.02,86.05 27.1,75.1 39.17,76.12 44.07,81.4 44.07,78.86 44.17,75 49.51,62.25 47.42,59.61 49.74,59.1 58.37,72.76 50.5,83.15 35.56,86 40.34,86.25 8.54,85.08 17.66,66.16 17.53,61.31 22.18,57.09 10.11,60.93 23.29,32.07 19.28,31.72 17.12,21.73 21.62,22.22 21.64,20.34 17.5,20.36 37.47,6.34 49.89,4.08 40.85,5.25 32.03,25.6 33.86,23.56 29.72,23.92 34.45,27.03 38.89,26.48 49.76,30.65 50.22,23.59 30.99,33.22 40.46,33.32 35.41,33.27 49.38,28.95 61.67,41.27 63.73,38.91 61.95,32.73 18.98,15.97 23.98,19.93 26.6,26.89 13.79,18.05 24.56,11.85 16.99,4.51 20.04,5.12 27.64,5.07 30.91,5.07 63.27,9.26 60.94,22.22 45.85,9.14 41.05,14.11 64.21,20.41 61.32,16.48 18.52,21.76 20.02,21.73 19.69,20.54 18.8,20.87 36.71,23.44 37.85,22.24 29.03,41.65 25.88,39.21 28.88,39.54 27.43,40.51 21.06,42.44 22.18,43.83 21.03,44.04 18.01,42.44 17.78,40.61 15.22,41.12 17.25,45.2 32.84,53.26 49.46,33.93 49.68,18.15 44.93,18.56 41.35,18.46 58.19,13.3 63.2,4.92 32.51,11.19 33.78,13.25 36.88,18.13
  pour Top (isolate 0.254, rank 6): -0.95,95 -0.95,0 106.05,0 106.05,95
  pour Bottom (isolate 0.254, rank 6): 0.05,0 106.05,0 106.05,95 0.05,95
IM1
  Top 0.305: P5.39 27,44.17 R36.1 25.61,47.03 R35.2
IO0  (via drill 0.3)
  Top 0.305: BOOT.2 R22.1 26.75,25.65 Q1.3 26.11,25.02 v25.28,25.02 | v46.94,70.81 57.94,70.81 59.47,69.29 U1.27
  Bottom 0.305: v46.94,70.81 46.94,69.11 28.2,50.37 28.2,43 20.63,35.43 20.63,29.67 v25.28,25.02
IO1  (via drill 0.3)
  Top 0.254: 36.81,46.66 R16.1
  Top 0.305: v36.81,47.35 36.81,46.66 | U1.39 v47.66,84.53 v47.65,84.53
  Bottom 0.305: v36.81,47.35 36.81,58.04 47.65,68.89 v47.65,84.53
IO1/CS
  Top 0.406: D4.1 44.3,56.22 R18.1 49.03,56.24 50,55.26 SD.2
IO2/CMD  (via drill 0.3)
  Top 0.254: SD.3
  Top 0.305: v53.34,54.15 SD.3 | U1.38 v53.35,83.26 v53.34,83.26
  Top 0.406: D4.3 v42.27,54.65 41.3,54.65 R19.1 | SD.3 49.88,54.16 48.54,55.5 v46.26,55.5
  Bottom 0.305: v53.34,83.26 v53.34,54.15
  Bottom 0.406: v46.26,55.5 43.12,55.5 v42.27,54.65
IO4  (via drill 0.3)
  Top 0.305: v12.63,52.78 v12.62,52.78 J1.1 | U1.4 41.55,81.99 v41.53,81.97
  Bottom 0.305: v41.53,81.97 22.51,81.97 12.63,72.08 v12.63,52.78
IO5  (via drill 0.3)
  Top 0.305: v13.34,51.54 13.33,51.53 J1.2 | U1.5 v41.59,80.72 v41.58,80.72
  Bottom 0.305: v41.58,80.72 41.05,81.25 22.96,81.25 13.34,71.63 v13.34,51.54
IO6  (via drill 0.3)
  Top 0.305: v12.47,41.25 J2.1 | U1.6 v41.59,79.45 v41.58,79.45
  Bottom 0.305: v41.58,79.45 40.39,80.64 23.42,80.64 14.13,71.35 14.13,42.9 v12.47,41.25
IO7  (via drill 0.3)
  Top 0.305: v12.53,40.01 11.36,40.01 J2.2 | U1.7 v41.64,78.18 v41.63,78.18
  Bottom 0.305: v41.63,78.18 39.78,80.03 23.8,80.03 14.86,71.09 14.86,42.34 v12.53,40.01
IO8  (via drill 0.3)
  Top 0.305: v22.36,59.84 R32.2 | U1.12 v41.63,71.83
  Bottom 0.305: v41.63,71.83 29.65,59.84 v22.36,59.84
IO9  (via drill 0.3)
  Top 0.305: U1.17 46.92,68.88 48.24,70.21 57.56,70.21 58.25,69.52 v58.25,69.37 | P2.4 45.75,27 45.98,27.23 49.08,27.23 49.79,27.94 50.19,28.35 R42.1 55.15,33.05 55.32,33.05 58.22,33.05 | 58.22,33.05 v58.25,33.05 58.22,33.05
  Bottom 0.305: v58.25,69.37 58.25,33.93 | 58.25,33.93 v58.25,33.05 58.25,33.93
IO10  (via drill 0.3)
  Top 0.305: P2.5 46.25,22.69 47.12,21.82 48.05,21.82 49.76,21.82 52.56,24.61 52.56,25.25 | U1.18 48.19,69.06 48.64,69.52 v52.66,69.52 | 52.56,25.25 52.56,25.4 52.51,25.45 | v52.66,28.45 52.66,25.58 arc-90 R47.1 52.48,25.32 arc90 52.56,25.25
  Bottom 0.305: v52.66,69.52 52.66,35 v52.66,28.45
IO12/HMISO  (via drill 0.3)
  Top 0.305: R2.1 39.95,47.01 D1.+ 39.93,47.57 v39.5,48.01 | U1.20 50.73,67.23 50.24,66.75 v47.43,66.75
  Bottom 0.305: v39.5,48.01 39.5,58.83 v47.43,66.75
IO13/HMOSI  (via drill 0.3)
  Top 0.305: U1.21 52,66.98 51.06,66.04 v47.7,66.04 | v39.86,41.94 40.01,42.09 40.01,43.26 P5.13
  Bottom 0.305: v47.7,66.04 40.16,58.5 40.16,43.56 40.16,42.24 v39.86,41.94
IO14/HSCLK  (via drill 0.3)
  Top 0.305: U1.22 53.27,67.08 51.54,65.35 v48.01,65.35 | 41,42.95 P5.11 41,43.03 | v41.1,41.86 41,41.96 41,43.03 | 41,43.03
  Bottom 0.305: v48.01,65.35 40.85,58.19 40.85,43.1 40.85,42.11 v41.1,41.86
IO15/HNSS0  (via drill 0.3)
  Top 0.305: P5.9 42,41.03 v42.19,41.22 | U1.8 45.93,76.91 v48.34,74.5
  Bottom 0.305: v48.34,74.5 48.34,68.66 37.52,57.84 37.52,42.06 38.36,41.22 v42.19,41.22
IO16  (via drill 0.3)
  Top 0.305: v16.61,71.65 U3.6 | U1.9 v41.54,75.64 v41.53,75.64
  Bottom 0.305: v41.53,75.64 41.53,77.24 39.32,79.45 24.41,79.45 v16.61,71.65
IO17  (via drill 0.3)
  Top 0.305: v15.75,69.47 U3.7 | U1.10 v41.64,74.37 v41.63,74.37
  Bottom 0.305: v41.63,74.37 40.85,75.16 40.85,76.96 38.94,78.87 25.15,78.87 v15.75,69.47
IO18  (via drill 0.3)
  Top 0.305: R33.2 22.66,48.62 v22.66,48.01 R6.1 | U1.11 v43.58,73.1 v43.59,73.1
  Bottom 0.305: 22.69,44.81 v22.66,48.01 22.66,51.84 43.59,72.77 v43.59,73.1
IO21/LCD_RS  (via drill 0.3)
  Top 0.305: P5.10 41.5,44.46 | U1.23 54.54,67.16 52.07,64.69 v48.29,64.69 | R34.2 41.5,45.11 41.5,44.46 | 41.5,44.46 v41.53,44.42
  Bottom 0.305: v41.53,44.42 41.53,57.94 v48.29,64.69
IO38/TWI_SDA  (via drill 0.3)
  Top 0.305: U1.31 v56.77,74.37 | P2.2 44.75,24.97 | 44.75,24.97 44.75,21.73 46.16,20.32 50.09,20.32 52.1,22.33 52.14,22.36 U5.8 53.86,22.36 v53.83,22.33 | v53.83,22.33 53.83,22.35 v53.83,22.33 | 44.4,24.69 43.36,24.69 42.88,25.17 40.44,25.17 39.4,24.13 R44.1 | 44.4,24.69 44.75,24.69 44.75,24.97 | 44.68,24.97 44.4,24.69 | 44.4,24.69 44.73,24.36
  Bottom 0.305: v56.77,74.37 56.77,36 56.77,25.27 v53.83,22.33
IO39/TWI_SCK  (via drill 0.3)
  Top 0.305: P2.3 45.25,25.45 | U1.32 v56.09,75.64 | 45.25,25.45 45.25,26.97 45.22,27 44.96,27.25 44.45,27.25 40.74,27.25 38.99,27.25 38.36,27.25 R43.1 | 45.25,25.45 45.25,22.01 46.43,20.83 49.81,20.83 51.82,22.84 51.85,22.86 53.44,22.86 | 53.44,22.86 v53.5,22.95 | v53.5,22.95 53.44,22.86 | U5.7 53.58,22.86 v53.5,22.95
  Bottom 0.305: v56.09,75.64 56.09,32 56.09,25.45 53.58,22.95 v53.5,22.95
IO40  (via drill 0.3)
  Top 0.305: U1.33 v55.41,76.91 v55.4,76.91
  Bottom 0.305: v55.4,76.91 v55.4,30.96
IO41/D0  (via drill 0.3)
  Top 0.254: SD.7
  Top 0.305: SD.7 v54.71,49.76 | U1.34 v54.72,78.18 v54.71,78.18
  Top 0.406: SD.7 46.66,49.76 | 46.66,49.76 46.28,49.76 | 46.28,49.76 45.8,49.76 | 45.8,49.76 44.95,49.76 R23.1 | D4.6 45.63,52.85 46.23,52.25 46.23,50.19 | 46.23,50.19 46.23,49.81 46.28,49.76 | 45.8,49.76 46.23,50.19 | 46.23,50.19 46.66,49.76
  Bottom 0.305: v54.71,78.18 v54.71,49.76
IO42/SCLK  (via drill 0.3)
  Top 0.254: SD.5
  Top 0.305: SD.5 v54.03,51.97 | U1.35 v54.03,79.45
  Top 0.406: D4.5 43.55,52.36 44.77,51.14 R21.1 v45.42,51.1 | SD.5 49.09,51.96 48.24,51.1 v47.2,51.1
  Bottom 0.305: v54.03,79.45 v54.03,51.97
  Bottom 0.406: v47.2,51.1 v45.42,51.1
IO48  (via drill 0.3)
  Top 0.305: v57.46,71.5 v44.1,71.5 | v24.13,52.5 R41.2 | U1.25 57.08,68.94 v57.46,69.32
  Bottom 0.305: v57.46,69.32 v57.46,71.5 | v24.13,52.5 24.13,52.3 43.34,71.5 v44.1,71.5
LCD_RST
  Top 0.305: P5.15 39,44.47 C1.2 R16.2 R13.1
LEDRUN
  Top 0.61: U3.1 15.49,82.66 25,73.15 R31.1
LEDRX
  Top 0.61: U3.5 15.98,73.86 19.31,70.54 R28.1
LEDTX
  Top 0.61: U3.4 15.91,76.06 20.83,71.14 R27.1
N$1
  Top 0.305: USB-TTL.A5 17.57,11.51 15.6,13.49 R46.2
N$2
  Top 0.61: R27.2 D5.A
N$3
  Top 0.61: R28.2 19.33,60.48 D6.A
N$4
  Top 0.305: P5.14 39.5,44.19 D1.- 39.93,45.12 R2.2
N$5
  Top 0.305: Q2.1 22.63,26.68 R30.1
N$6
  Top 0.61: R31.2 D7.A
N$7
  Top 0.406: R12.1 19.56,41.71 19.59,41.73 19.59,41.76 PWR.C
N$8
  Top 0.305: Q1.1 23.78,26.32 R29.1
N$9
  Top 0.406: U6.6 55.78,17.78 R51.2
N$10
  Top 0.61: U3.2 15.81,80.46 23.65,72.62 23.65,53.52 22.15,52.02 R33.1
N$11
  Top 0.61: U3.3 16.03,78.26 22.36,71.93 R32.1
N$12
  Top 0.406: U6.2 54.51,8.33 54.56,8.33 R48.1
N$13
  Top 0.406: U6.7 54.51,17.96 R50.2
N$14
  Top 0.305: USB-NATIVE.A5 28.6,14.35 R15.2
N$15  (via drill 0.3)
  Top 0.305: v30.46,17.09 R20.2 | U1.13 v43.62,70.56
  Bottom 0.305: v30.46,17.09 17.66,17.09 14.1,20.65 14.1,33.83 24.95,44.68 24.95,51.89 v43.62,70.56
N$16  (via drill 0.3)
  Top 0.305: v31.98,17.78 R5.2 | U1.14 42.62,69.27 v42.62,68.61
  Bottom 0.305: v31.98,17.78 18.06,17.78 14.76,21.08 14.76,33.43 25.63,44.3 25.63,51.61 v42.62,68.61
N$17
  Top 0.305: USB-NATIVE.B5 31.6,12.72 R14.2
N$18
  Top 0.305: USB-TTL.B5 20.57,14.4 R11.2
N$19
  Top 0.406: R50.1 53.33,19.58 arc-90 CHRG.C
N$20
  Top 0.305: P5.34 29.5,43.64 29.5,46.23 31.78,48.51 31.78,49.07 | 31.78,49.07 31.8,49.1 | 31.78,49.07 31.78,49.08 R37.1
N$21
  Top 0.305: P5.35 29,47.8 R38.1
N$22
  Top 0.305: P5.36 28.5,48.8 R39.1
N$23
  Top 0.305: Q3.1 R40.1 R41.1
N$24
  Top 0.305: Q3.3 R39.2 R38.2 R37.2
N$26  (via drill 0.3)
  Top 0.254: R9.1 v25.3,20.98 | v30,38.33 30,40 P5.33
  Top 0.61: R10.1 R9.1
  Bottom 0.254: v25.3,20.98 25.91,21.59 25.91,25.32 21.29,29.95 21.29,34.98 24.64,38.33 v30,38.33
N$27
  Top 0.61: U3.11 36.03,71.66 J3.3
N$28
  Top 0.61: U3.12 35.69,73.86 J3.2
N$29
  Top 0.406: R51.1 56.06,20.5 55.27,21.29 52.38,21.29 51.54,20.45 51.54,19.82 DONE.C
N$36
  Top 0.406: U2.9 17.9,24.8 R80.2
N$37
  Top 0.406: U2.8 18.9,25.32 R79.2
N$47
  Top 0.406: SD.1 50.42,56.36 49.61,57.17 44.9,57.17 R17.1
N$48
  Top 0.406: SD.8 45.97,48.66 45.39,48.08 R24.1
RESET  (via drill 0.3)
  Top 0.305: U1.3 v44.99,83.26 | v15.45,29.82 18.89,29.82 RST.2 20.09,28.61 Q2.3
  Top 0.61: U1.3 40.05,83.26 R4.1 C8.1
  Bottom 0.305: v15.45,29.82 15.45,33.1 26.29,43.94 26.29,51.28 44.99,69.98 v44.99,83.26
RTS
  Top 0.305: U2.6 21.11,24.12 21.11,28.14 22.06,29.09 Q2.2 23.74,29.09 R29.2
RXD/IO44  (via drill 0.3)
  Top 0.254: R79.1 v18.09,28.37 | 60.09,80.7 U1.36
  Top 0.305: 60.09,80.7 v46.35,80.7
  Bottom 0.305: v18.09,28.37 18.09,33.88 27.56,43.36 27.56,50.65 46.26,69.34 46.26,80.6 v46.35,80.7
TXD/IO43  (via drill 0.3)
  Top 0.254: v16.56,28.35 R80.1
  Top 0.305: U1.37 45.72,81.99 v45.7,81.97
  Bottom 0.305: v16.56,28.35 16.56,33.3 26.93,43.66 26.93,50.95 45.62,69.65 45.62,81.89 v45.7,81.97
USB_D+
  Top 0.305: USB-NATIVE.B6 30.6,9.58 | 30.6,9.58 30.6,13.32 R5.1 | USB-NATIVE.A6 29.6,9.38 29.82,9.6 30.28,9.6 | 30.28,9.6 30.57,9.6 30.6,9.58 | 30.58,9.3 30.28,9.6 | 30.28,9.6 30.58,9.91
USB_D-
  Top 0.305: R20.1 29.1,13.35 USB-NATIVE.B7 29.1,7.3 29.31,7.09 29.9,7.09 30.1,7.29 USB-NATIVE.A7
V_BATT  (via drill 0.3)
  Top 0.305: U5.2 56.92,22.86 arc-90 56.9,22.89 56.9,23.32 arc90 56.87,23.34 57.08,23.34 | 57.08,23.34 57.1,23.34 57.1,22.94 arc-90 57.08,22.91 57.28,22.91 57.28,23.32 arc-90 57.31,23.34 58.22,23.34 arc-90 58.3,23.27 58.3,23.09 arc-90 58.25,23.04 57.23,23.04 arc-90 57.08,23.19 57.08,23.01 arc90 57.2,22.89 58.09,22.89 arc-90 58.14,22.84 58.14,22.55 arc90 58.22,22.48 | 58.22,22.48 58.19,22.48 57.81,22.86 57.81,23.29 57.81,23.34 58.14,23.67 58.14,23.47 57.94,23.27 57.15,23.27 57.08,23.34 | 57.08,23.34 U5.3 | C36.1 57.51,20.68 57.53,20.7 57.56,20.7 | 58.47,21.61 58.47,22.23 58.22,22.48 | 57.56,17.93 57.53,17.96 C15.1
  Top 0.406: U6.5 57.05,17.5 C15.1
  Top 1.016: BAT.+ 56.71,26.99 57.53,26.16 58.47,25.22 58.47,25.04 | 58.47,25.04 58.47,21.61 57.56,20.7 57.56,17.93 57.56,16.79 | 57.56,16.79 57.56,16.2 57.31,15.95 | Q4.3 47.29,16.82 v48.16,15.95 | v58.07,15.95 57.56,16.46 57.56,16.79 | C11.1 58.47,25.04
  Bottom 1.016: v48.16,15.95 v58.07,15.95
VBUS  (via drill 0.3)
  Top 0.61: C44.2 14.02,13.54 16.37,11.19 USB-TTL.VBUS1 16.37,9.77 v16.36,9.78 | USB-TTL.VBUS2 v21.27,9.78 21.27,10.31 21.27,14.26 C3.1 C4.2 23.52,14.78 D3.+ D2.+
  Bottom 0.61: v16.36,9.78 v21.27,9.78
VPWR  (via drill 0.3)
  Top 0.305: C19.1 31.35,19.56 | 32.85,19.86 32.73,19.98 U4.3
  Top 1.016: C16.1 C19.1 31.35,19.56 31.52,19.56 31.83,19.86 32.85,19.86 33.3,19.41 38,19.41 v38.48,18.92 | v38.99,14.25 38.03,14.25 Q4.2 37.8,14.47 D8.- 37.93,13.43 37.93,13.44 38.71,14.22 38.74,14.22
  Bottom 1.016: v38.48,18.92 38.48,14.76 v38.99,14.25

### Text on the board
tPlace: 3V3 | CLK | DIO | GND | MaTouch ESP32-S3 MaUWB SPI TFT | with Touch 3.95'' | ST7796 v1.1 | www.makerfabs.com | IO4 | IO5 | 3V3 | GND | IO6 | IO7 | 3V3 | GND | - | +